# EAGLE design PCB_HYDRA_Sensors_V1.1 (EAGLE 8.4.0)
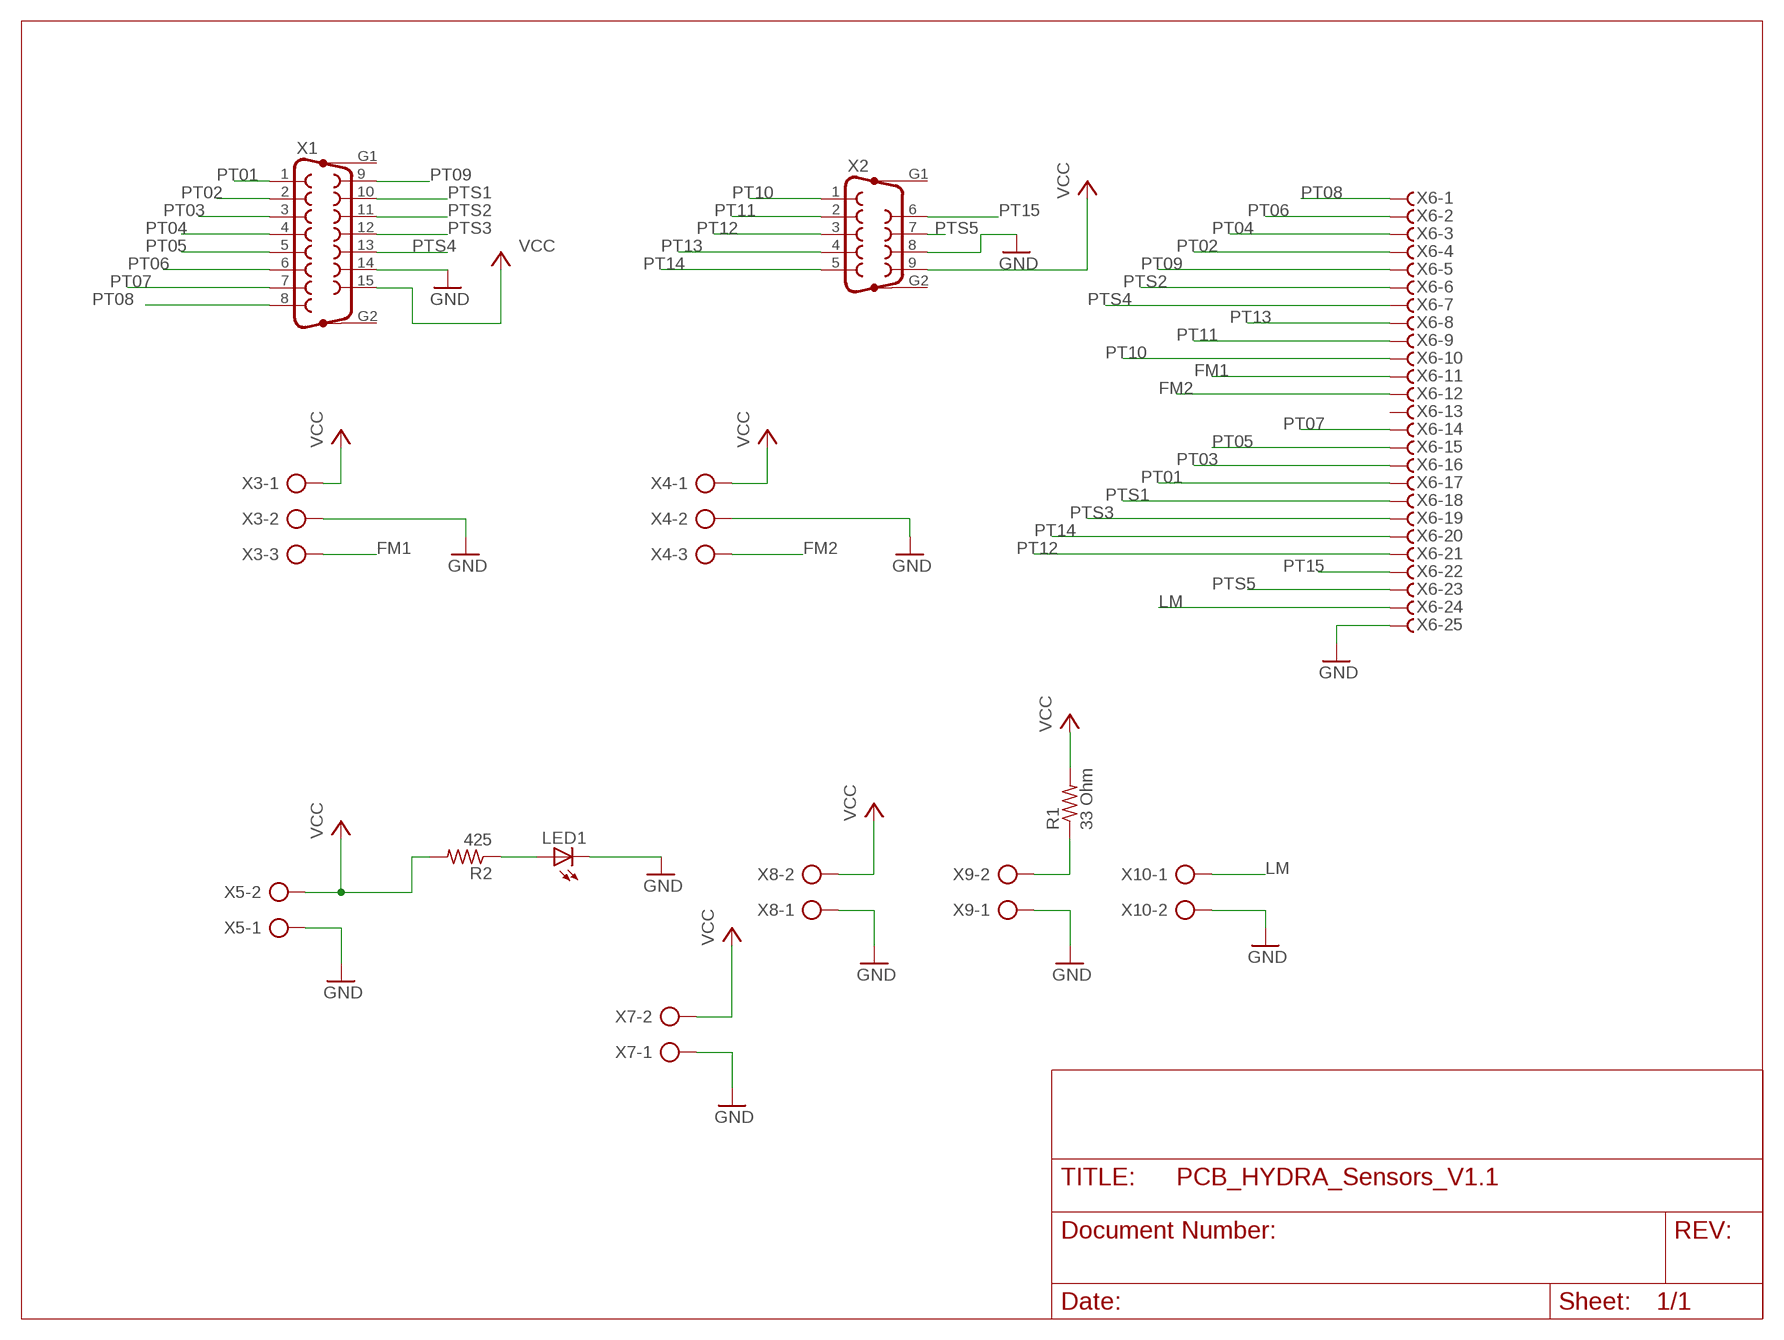
[diagram p0: schematic, sheet 1]

## Parts
LED1  LEDCHIPLED_0805  [CHIPLED_0805]
R1  33 Ohm  R-US_M1206  [M1206]
R2  425  R-US_M1206  [M1206]
X1  F15HP  [F15HP]
X2  F09HP  [F09HP]
X3  AK300/3  [AK300/3]
X4  AK300/3  [AK300/3]
X5  AK300/2  [AK300/2]
X6  F25HPS  [F25HP]
X7  AK300/2  [AK300/2]
X8  AK300/2  [AK300/2]
X9  AK300/2  [AK300/2]
X10  AK300/2  [AK300/2]

## Nets
FM1: X3.3 X6.11
FM2: X4.3 X6.12
GND: LED1.C X1.14 X2.8 X3.2 X4.2 X5.1 X6.25 X7.1 X8.1 X9.1 X10.2
LM: X6.24 X10.1
N$1: R1.1 X9.2
N$17: LED1.A R2.1
PT01: X1.1 X6.17
PT02: X1.2 X6.4
PT03: X1.3 X6.16
PT04: X1.4 X6.3
PT05: X1.5 X6.15
PT06: X1.6 X6.2
PT07: X1.7 X6.14
PT08: X1.8 X6.1
PT09: X1.9 X6.5
PT10: X2.1 X6.10
PT11: X2.2 X6.9
PT12: X2.3 X6.21
PT13: X2.4 X6.8
PT14: X2.5 X6.20
PT15: X2.6 X6.22
PTS1: X1.10 X6.18
PTS2: X1.11 X6.6
PTS3: X1.12 X6.19
PTS4: X1.13 X6.7
PTS5: X2.7 X6.23
VCC9: R1.2 R2.2 X1.15 X2.9 X3.1 X4.1 X5.2 X7.2 X8.2 ; supply symbol labelled VCC
Unconnected: X1.G1 X1.G2 X2.G1 X2.G2 X6.13

## Library data of the parts
LED1 = led:LED: LED OSRAM: - CHIPLED LG R971, LG N971, LY N971, LG Q971, LY Q971, LO R971, LY R971 LH N974, LH R974 LS Q976, LO Q976, LY Q976 LO Q996 - Hyper CHIPLED LW Q18S LB Q993, LB Q99A, LB R99A - SideLED LS A670, LO A670, LY A670, LG A670, LP A670 LB A673, LV A673, LT A673, LW A673 LH A674 LY A675 LS A676, LA A676, LO A676, LY A676, LW A676 LS A679, LY A679, LG A679 - Hyper Micro SIDELED® LS Y876, LA Y876, LO Y876, LY Y876 LT Y87S - SmartLED LW L88C, LW L88S LB L89C, LB L89S, LG L890 LS L89K, LO L89K, LY L89K LS L896, LA L896, LO L896, LY L896 - TOPLED LS T670, LO T670, LY T670, LG T670, LP T670 LSG T670, LSP T670, LSY T670, LOP T670, LYG T670 LG T671, LOG T671, LSG T671 LB T673, LV T673, LT T673, LW T673 LH T674 LS T676, LA T676, LO T676, LY T676, LB T676, LH T676, LSB T676, LW T676 LB T67C, LV T67C, LT T67C, LS T67K, LO T67K, LY T67K, LW E67C LS E67B, LA E67B, LO E67B, LY E67B, LB E67C, LV E67C, LT E67C LW T67C LS T679, LY T679, LG T679 LS T770, LO T770, LY T770, LG T770, LP T770 LB T773, LV T773, LT T773, LW T773 LH T774 LS E675, LA E675, LY E675, LS T675 LS T776, LA T776, LO T776, LY T776, LB T776 LHGB T686 LT T68C, LB T68C - Hyper Mini TOPLED® LB M676 - Mini TOPLED Santana® LG M470 LS M47K, LO M47K, LY M47K Source: http://www.osram.convergy.de LUXEON: - LUMILED® LXK2-PW12-R00, LXK2-PW12-S00, LXK2-PW14-U00, LXK2-PW14-V00 LXK2-PM12-R00, LXK2-PM12-S00, LXK2-PM14-U00 LXK2-PE12-Q00, LXK2-PE12-R00, LXK2-PE12-S00, LXK2-PE14-T00, LXK2-PE14-U00 LXK2-PB12-K00, LXK2-PB12-L00, LXK2-PB12-M00, LXK2-PB14-N00, LXK2-PB14-P00, LXK2-PB14-Q00 LXK2-PR12-L00, LXK2-PR12-M00, LXK2-PR14-Q00, LXK2-PR14-R00 LXK2-PD12-Q00, LXK2-PD12-R00, LXK2-PD12-S00 LXK2-PH12-R00, LXK2-PH12-S00 LXK2-PL12-P00, LXK2-PL12-Q00, LXK2-PL12-R00 Source: www.luxeon.com KINGBRIGHT: KA-3528ASYC Source: www.kingbright.com; OC_NEWARK: unknown
R1 = rcl:R-US_: RESISTOR, American symbol
R2 = rcl:R-US_: RESISTOR, American symbol; MPN: M2012ES1G01; OC_NEWARK: 10X5877
X1 = con-subd:F15HP: SUB-D; OC_FARNELL: unknown; OC_NEWARK: unknown
X2 = con-subd:F09HP: SUB-D; OC_FARNELL: unknown; OC_NEWARK: unknown
X3 X4 = con-ptr500:AK300/3: CONNECTOR; OC_FARNELL: unknown; OC_NEWARK: unknown
X5 X7-X10 = con-ptr500:AK300/2: CONNECTOR; OC_FARNELL: unknown; OC_NEWARK: unknown
X6 = con-subd:F25?S: SUB-D; OC_FARNELL: unknown; OC_NEWARK: unknown

## Board
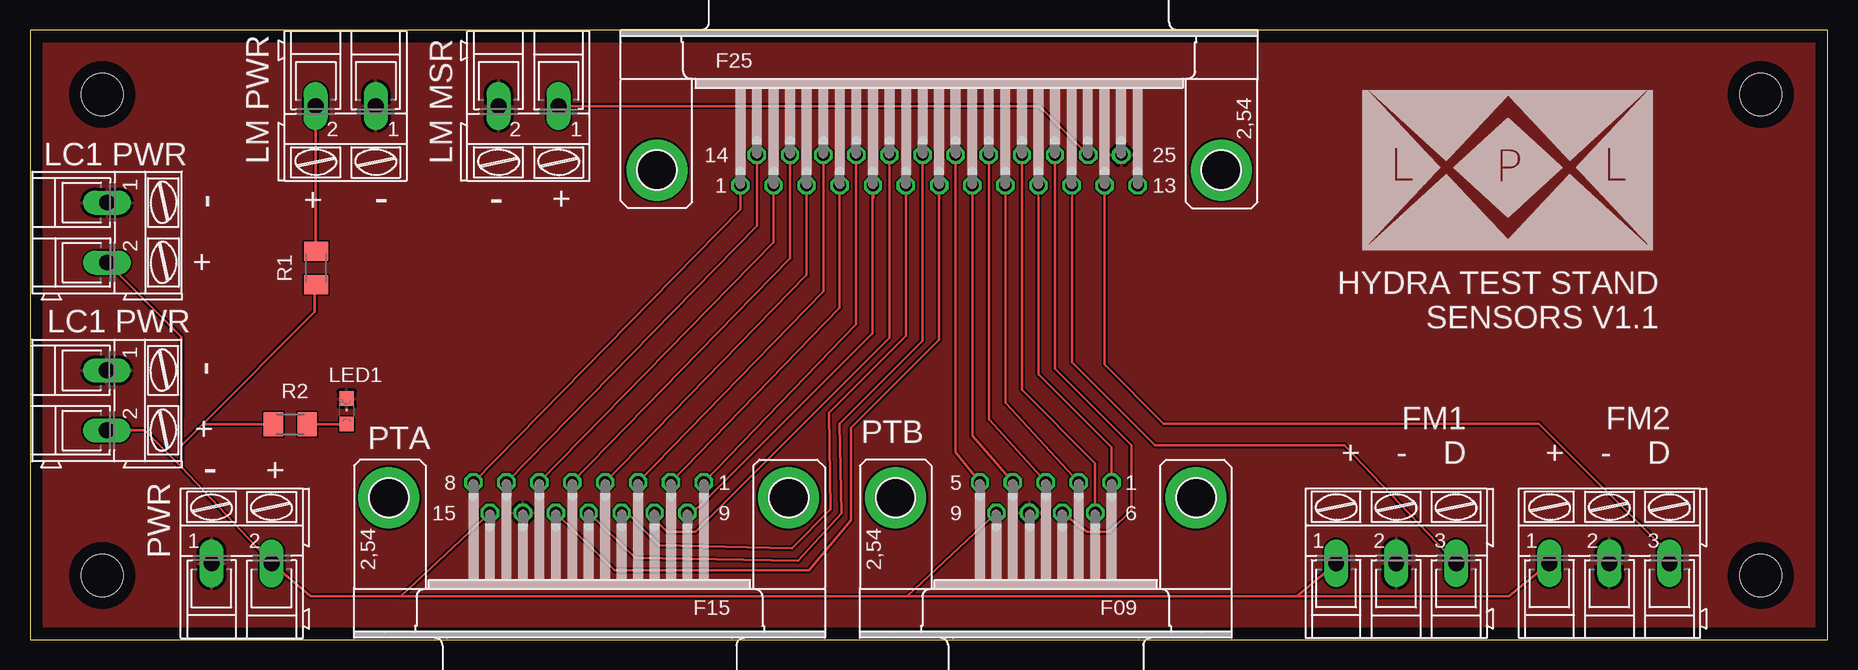
[diagram p1: board, top side]
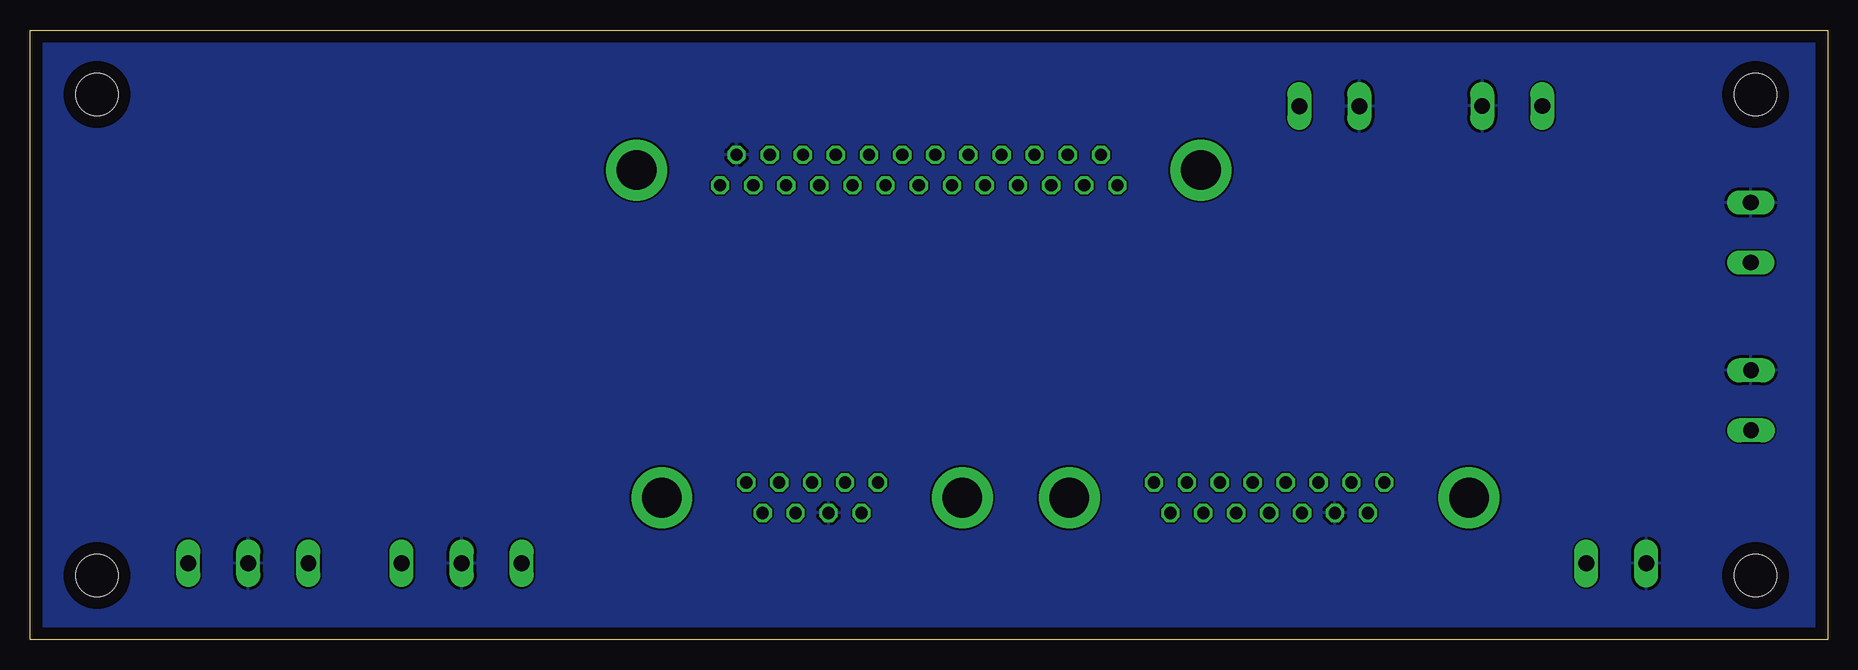
[diagram p2: board, bottom side, seen from below]

Size 149.86 x 50.8 mm. Coordinates in mm from the lower left corner, seen from the top.
Outline: 0,0 149.86,0 149.86,50.8 0,50.8 0,0
Copper layers (1*16): Top 0.035mm / dielectric 1.5mm / Bottom 0.035mm
Design rules "default": minimum track width 6mil, minimum drill 0.35mm, track to track 6mil, track to pad 6mil, pad to pad 6mil, via to via 6mil, smd to smd 6mil, copper to edge 40mil, drill to drill 6mil, minimum pad ring 10mil, minimum via ring 8mil, stop-mask expansion 4mil, vias tented up to drill 0mil, thermal gap 10mil
Holes 3.51 mm at 6.02,5.33 6.02,45.42 144.27,5.33 144.27,45.42

### Footprints (pad centres in the part's own frame; a part is rotated, then mirrored left to right if it is on the bottom)
CHIPLED_0805 = smd 1.2 x 1.2: A 0,-1.05; C 0,1.05
M1206 = smd 1.6 x 2: 1 -1.4,0; 2 1.4,0
F15HP = drill 1.016 octagon: 1 -9.601,-1.27; 2 -6.858,-1.27; 3 -4.115,-1.27; 4 -1.372,-1.27; 5 1.372,-1.27; 6 4.115,-1.27; 7 6.858,-1.27; 8 9.601,-1.27; 9 -8.23,1.27; 10 -5.486,1.27; 11 -2.743,1.27; 12 0,1.27; 13 2.743,1.27; 14 5.486,1.27; 15 8.23,1.27 | drill 3.302 pad 5.08: G1 -16.662,0; G2 16.662,0
F09HP = drill 1.016 octagon: 1 -5.486,-1.27; 2 -2.743,-1.27; 3 0,-1.27; 4 2.743,-1.27; 5 5.486,-1.27; 6 -4.115,1.27; 7 -1.372,1.27; 8 1.372,1.27; 9 4.115,1.27 | drill 3.302 pad 5.08: G1 -12.522,0; G2 12.522,0
AK300/3 = drill 1.321 long: 1 -5.004,0; 2 0,0; 3 5.004,0
AK300/2 = drill 1.321 long: 1 -2.515,0; 2 2.489,0
F25HP = drill 1.016 octagon: 1 -16.561,-1.27; 2 -13.792,-1.27; 3 -11.049,-1.27; 4 -8.28,-1.27; 5 -5.512,-1.27; 6 -2.769,-1.27; 7 0,-1.27; 8 2.769,-1.27; 9 5.512,-1.27; 10 8.28,-1.27; 11 11.049,-1.27; 12 13.792,-1.27; 13 16.561,-1.27; 14 -15.189,1.27; 15 -12.421,1.27; 16 -9.652,1.27; 17 -6.909,1.27; 18 -4.14,1.27; 19 -1.372,1.27; 20 1.372,1.27; 21 4.14,1.27; 22 6.909,1.27; 23 9.652,1.27; 24 12.421,1.27; 25 15.189,1.27 | drill 3.302 pad 5.08: G1 -23.52,0; G2 23.52,0

### Placement (x,y rotation side)
LED1  26.4,19.03 0 top
R1  23.87,30.96 270 top
R2  21.7,17.94 180 top
X1  46.57,11.82 180 top
X2  84.67,11.82 180 top
X3  113.88,6.36 0 top
X4  131.66,6.36 0 top
X5  17.65,6.35 0 top
X6  75.78,39.13 0 top
X7  6.4,19.93 270 top
X8  6.42,33.91 270 top
X9  26.3,44.47 180 top
X10  41.54,44.46 180 top

### Tracks (layer width: path | path; a pad name or v marks a point on that pad's centre or on a via)
FM1
  Top 0.152: X6.11 86.87,36.8
  Top 0.203: 86.87,36.8 86.87,23.11 93.78,16.2 109.55,16.2 X3.3
FM2
  Top 0.152: 136.56,7.22 X4.3
  Top 0.203: X6.12 89.57,22.93 94.5,18 125.78,18 136.56,7.22
GND
  pour Top: 0,100.33 0,0.64 157.48,0.64 157.48,100.33
  pour Bottom: -4.5,53.1 -4.5,-7.2 162.9,-7.2 162.9,54 -3.6,54
LM
  Top 0.203: X6.24 84.14,44.46 X10.1
N$1
  Top 0.152: 23.81,32.42 R1.1
  Top 0.203: X9.2 23.81,32.42
N$17
  Top 0.152: 26.36,17.94 LED1.A
  Top 0.203: R2.1 26.36,17.94
PT01
  Top 0.203: X1.1 68.87,26.3 X6.17
PT02
  Top 0.203: X1.2 67.5,27.67 X6.4
PT03
  Top 0.203: X1.3 66.13,29.04 X6.16
PT04
  Top 0.203: X1.4 64.73,30.39 X6.3
PT05
  Top 0.203: X1.5 63.36,31.76 X6.15
PT06
  Top 0.203: X1.6 61.99,33.13 X6.2
PT07
  Top 0.203: X1.7 60.59,34.48 X6.14
PT08
  Top 0.203: X1.8 59.22,35.85 X6.1
PT09
  Top 0.152: 70.32,36.79 X6.5 70.23,36.8 | X1.9 55.76,11.06
  Top 0.203: 55.76,11.06 70.23,25.53 70.23,36.8
PT10
  Top 0.152: 84.07,36.83 X6.10
  Top 0.203: X2.1 90.16,16.02 84.07,22.1 84.07,36.83
PT11
  Top 0.152: 87.21,13.6 X2.2
  Top 0.203: X2.2 81.29,19.72 X6.9
PT12
  Top 0.203: X2.3 79.92,18.35 X6.21
PT13
  Top 0.152: 81.93,13.8 X2.4
  Top 0.203: X2.4 78.55,16.98 X6.8
PT14
  Top 0.203: X2.5 77.15,15.63 X6.20
PT15
  Top 0.203: X2.6 88.78,14.71 82.69,20.81 X6.22
PTS1
  Top 0.152: X1.10 52.06,10.04 | 71.63,39.37 X6.18
  Top 0.203: 52.06,10.04 53.1,9 55.48,9 71.63,25.15 71.63,39.37
PTS2
  Top 0.152: X1.11 49.31,11.01
  Top 0.203: 49.31,11.01 52.45,7.87 63.5,7.62 66.73,10.85 66.6,18.9 73.01,25.31 X6.6
PTS3
  Top 0.203: X1.12 50.43,6.82 64.03,6.57 67.63,10.55 67.5,18 74.41,24.91 X6.19
PTS4
  Top 0.152: 75.82,36.8 X6.7
  Top 0.203: X1.13 48.71,5.79 64.93,5.79 68.45,9.95 68.45,17.65 75.78,24.98 X6.7
PTS5
  Top 0.203: X2.7 88.1,9 90,9 91.8,10.8 91.8,16.2 85.43,22.57 X6.23
VCC9
  Top 0.152: 12.6,18.51 | 12.6,18.51 12.6,16.2 12.64,16.2 | R1.2 23.75,29.44 | 14.46,17.94 14.42,17.98
  Top 0.203: 12.6,18.51 12.6,25.24 X8.2 | 12.6,14.4 X5.2 23.4,3.6 30.88,3.6 | 12.6,14.4 9.56,17.44 X7.2 | 12.6,16.2 12.6,14.4 | 105.61,3.6 123.26,3.6 X4.1 | 73.09,3.6 105.61,3.6 | 30.88,3.6 73.09,3.6 | X3.1 105.61,3.6 | X2.9 73.09,3.6 | X1.15 30.88,3.6 | 23.75,29.44 23.75,27.3 14.42,17.98 12.64,16.2 | R2.2 14.46,17.94

### Text on the board
tPlace: LC1 PWR | LM PWR | LM MSR | + | - | - | - | + | + | HYDRA TEST STAND / SENSORS V1.1 | LC1 PWR | - | FM1 / + - D | FM2 / + - D | PTA | PTB | + | - | + | PWR